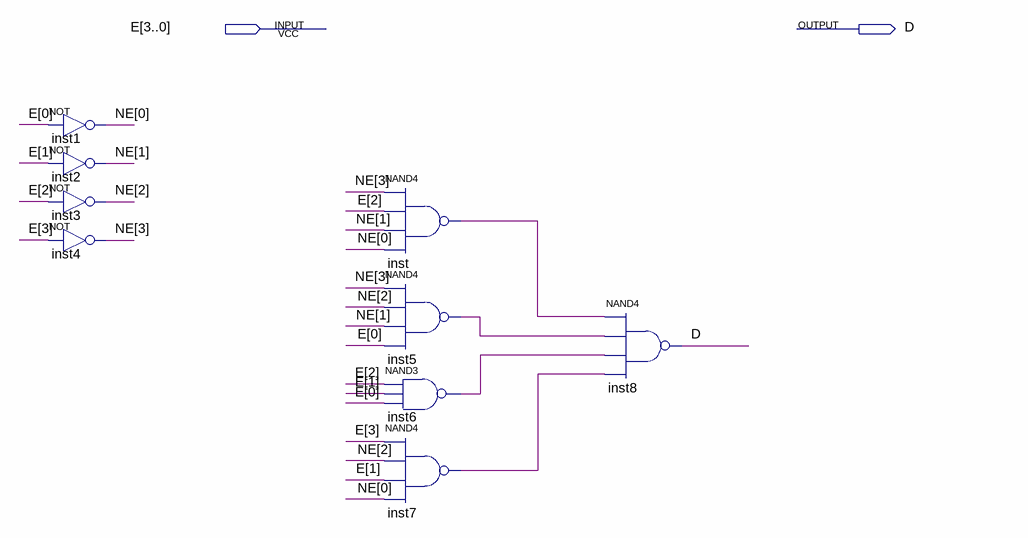
[diagram p0: schematic sheet]
// Quartus schematic Segmento_D.bdf as structural Verilog: 9 symbols, 2 pins
module Segmento_D (
  input  [3:0] E,
  output D
);

  wire inst5_out, inst6_out, inst7_out, inst_out;
  wire [3:0] NE;

  not inst1 (NE[0], E[0]);
  not inst2 (NE[1], E[1]);
  not inst3 (NE[2], E[2]);
  not inst4 (NE[3], E[3]);
  nand inst (inst_out, NE[3], E[2], NE[1], NE[0]);
  nand inst5 (inst5_out, NE[3], NE[2], NE[1], E[0]);
  nand inst6 (inst6_out, E[2], E[1], E[0]);
  nand inst7 (inst7_out, E[3], NE[2], E[1], NE[0]);
  nand inst8 (D, inst_out, inst5_out, inst6_out, inst7_out);
endmodule
